# EAGLE design highSideBreakout (EAGLE 6.5.0)
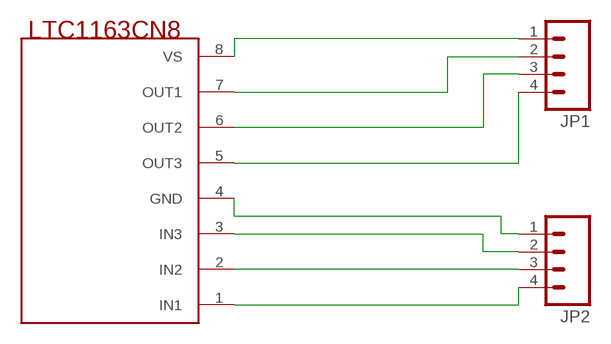
[diagram p0: schematic, sheet 1]

## Parts
JP1  M04PTH  [1X04]
JP2  M04PTH  [1X04]
U$1  LTC1163CN8  [SO08]

## Nets
GND: JP2.1 U$1.4(GND)
N$1: JP2.4 U$1.1(IN1)
N$2: JP2.3 U$1.2(IN2)
N$3: JP2.2 U$1.3(IN3)
N$5: JP1.4 U$1.5(OUT3)
N$6: JP1.3 U$1.6(OUT2)
N$7: JP1.2 U$1.7(OUT1)
N$8: JP1.1 U$1.8(VS)

## Library data of the parts
JP1 JP2 = SparkFun-Connectors:M04: Header 4 Standard 4-pin 0.1" header. Use with straight break away headers (SKU : PRT-00116), right angle break away headers (PRT-00553), swiss pins (PRT-00743), machine pins (PRT-00117), and female headers (PRT-00115). Molex polarized connector foot print use with SKU : PRT-08231 with associated crimp pins and housings. 1MM SMD Version SKU: PRT-10208
U$1 = hmcfabstudio:LTC1163CN8: Digikey: LTC1163CS8#PBF-ND Triple High-Side N-Channel Mosfet Driver

## Board
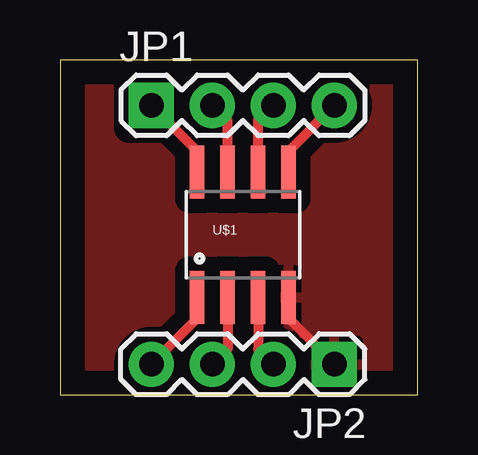
[diagram p1: board, top side]

Size 14.91 x 13.96 mm. Coordinates in mm from the lower left corner, seen from the top.
Outline: 0,0 14.91,0 14.91,13.96 0,13.96 0,0
Copper layers (1*16): Top 0.035mm / dielectric 1.5mm / Bottom 0.035mm
Design rules "default": minimum track width 10mil, minimum drill 24mil, track to track 8mil, track to pad 8mil, pad to pad 8mil, via to via 8mil, smd to smd 8mil, copper to edge 40mil, drill to drill 8mil, minimum pad ring 10mil, minimum via ring 8mil, stop-mask expansion 4mil, vias tented up to drill 0mil, thermal gap 10mil

### Footprints (pad centres in the part's own frame; a part is rotated, then mirrored left to right if it is on the bottom)
1X04 = drill 1.016 pad 1.88 square: 1 0,0 | drill 1.016 pad 1.88: 2 2.54,0; 3 5.08,0; 4 7.62,0
SO08 = smd 0.61 x 2.21: 1 -1.905,-2.616; 2 -0.635,-2.616; 3 0.635,-2.616; 4 1.905,-2.616; 5 1.905,2.616; 6 0.635,2.616; 7 -0.635,2.616; 8 -1.905,2.616

### Placement (x,y rotation side)
JP1  3.81,12.06 0 top
JP2  11.43,1.27 180 top
U$1  7.62,6.67 0 top

### Tracks (layer width: path | path; a pad name or v marks a point on that pad's centre or on a via)
GND
  Top 0.406: JP2.1 9.53,3.17 U$1.4
  pour Top (isolate 0.61): 0,0 0,13.97 14.92,13.97 14.92,0
N$1
  Top 0.406: U$1.1 5.71,3.17 JP2.4
N$2
  Top 0.406: U$1.2 6.99,1.91 JP2.3
N$3
  Top 0.406: U$1.3 8.26,1.91 JP2.2
N$5
  Top 0.406: U$1.5 9.53,10.16 JP1.4
N$6
  Top 0.406: U$1.6 8.26,11.43 JP1.3
N$7
  Top 0.406: U$1.7 6.99,11.43 JP1.2
N$8
  Top 0.406: U$1.8 5.71,10.16 JP1.1